# EAGLE design Oledy (EAGLE 5.11)
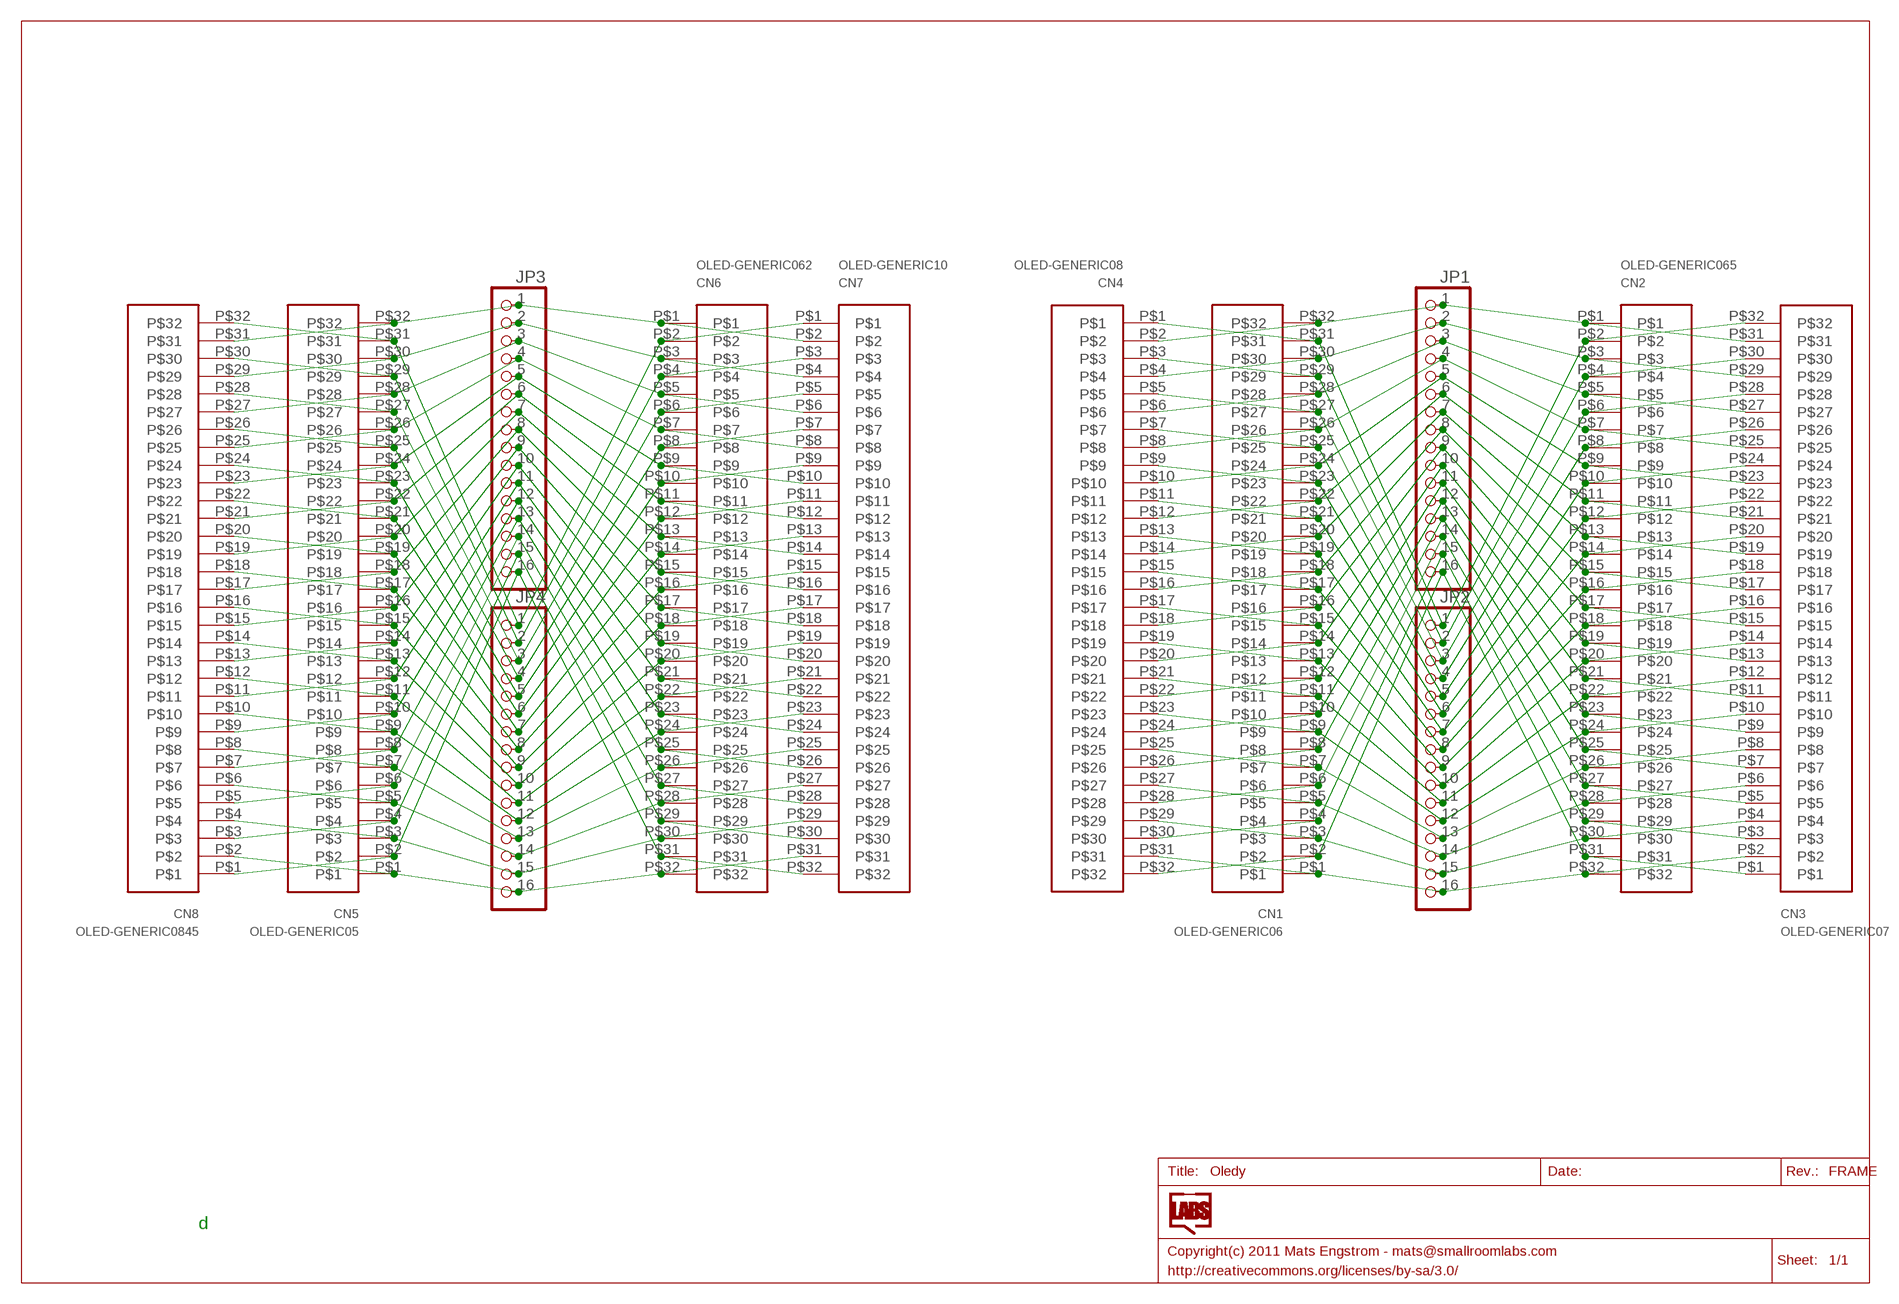
[diagram p0: schematic, sheet 1]

## Parts
CN1  OLED-GENERIC06  [OLED-GENERIC-0.6]
CN2  OLED-GENERIC065  [OLED-GENERIC-0.65]
CN3  OLED-GENERIC07  [OLED-GENERIC-0.7]
CN4  OLED-GENERIC08  [OLED-GENERIC-0.8]
CN5  OLED-GENERIC05  [OLED-GENERIC-0.5]
CN6  OLED-GENERIC062  [OLED-GENERIC-0.62]
CN7  OLED-GENERIC10  [OLED-GENERIC-1.0]
CN8  OLED-GENERIC0845  [OLED-GENERIC-0.845]
JP1  HEADER-1X16ROUND  [1X16_ROUND]
JP2  HEADER-1X16ROUND  [1X16_ROUND]
JP3  HEADER-1X16ROUND  [1X16_ROUND]
JP4  HEADER-1X16ROUND  [1X16_ROUND]

## Nets
N$1: CN1.P$1 CN2.P$32 CN3.P$2 CN4.P$31 JP2.16
N$2: CN1.P$2 CN2.P$31 CN3.P$1 CN4.P$32 JP1.16
N$3: CN1.P$3 CN2.P$30 CN3.P$4 CN4.P$29 JP2.15
N$4: CN1.P$5 CN2.P$28 CN3.P$6 CN4.P$27 JP2.14
N$5: CN1.P$7 CN2.P$26 CN3.P$8 CN4.P$25 JP2.13
N$6: CN1.P$9 CN2.P$24 CN3.P$10 CN4.P$23 JP2.12
N$7: CN1.P$4 CN2.P$29 CN3.P$3 CN4.P$30 JP1.15
N$8: CN1.P$6 CN2.P$27 CN3.P$5 CN4.P$28 JP1.14
N$9: CN1.P$8 CN2.P$25 CN3.P$7 CN4.P$26 JP1.13
N$10: CN1.P$10 CN2.P$23 CN3.P$9 CN4.P$24 JP1.12
N$11: CN1.P$11 CN2.P$22 CN3.P$12 CN4.P$21 JP2.11
N$12: CN1.P$12 CN2.P$21 CN3.P$11 CN4.P$22 JP1.11
N$13: CN1.P$13 CN2.P$20 CN3.P$14 CN4.P$19 JP2.10
N$14: CN1.P$14 CN2.P$19 CN3.P$13 CN4.P$20 JP1.10
N$15: CN5.P$1 CN6.P$32 CN7.P$31 CN8.P$2 JP4.16
N$16: CN5.P$2 CN6.P$31 CN7.P$32 CN8.P$1 JP3.16
N$17: CN5.P$3 CN6.P$30 CN7.P$29 CN8.P$4 JP4.15
N$18: CN5.P$5 CN6.P$28 CN7.P$27 CN8.P$6 JP4.14
N$19: CN5.P$7 CN6.P$26 CN7.P$25 CN8.P$8 JP4.13
N$20: CN5.P$9 CN6.P$24 CN7.P$23 CN8.P$10 JP4.12
N$21: CN5.P$4 CN6.P$29 CN7.P$30 CN8.P$3 JP3.15
N$22: CN5.P$6 CN6.P$27 CN7.P$28 CN8.P$5 JP3.14
N$23: CN5.P$8 CN6.P$25 CN7.P$26 CN8.P$7 JP3.13
N$24: CN5.P$10 CN6.P$23 CN7.P$24 CN8.P$9 JP3.12
N$25: CN5.P$11 CN6.P$22 CN7.P$21 CN8.P$12 JP4.11
N$26: CN5.P$12 CN6.P$21 CN7.P$22 CN8.P$11 JP3.11
N$27: CN5.P$13 CN6.P$20 CN7.P$19 CN8.P$14 JP4.10
N$28: CN5.P$14 CN6.P$19 CN7.P$20 CN8.P$13 JP3.10
N$29: CN1.P$15 CN2.P$18 CN3.P$16 CN4.P$17 JP2.9
N$30: CN1.P$16 CN2.P$17 CN3.P$15 CN4.P$18 JP1.9
N$31: CN1.P$17 CN2.P$16 CN3.P$18 CN4.P$15 JP2.8
N$32: CN1.P$18 CN2.P$15 CN3.P$17 CN4.P$16 JP1.8
N$33: CN1.P$19 CN2.P$14 CN3.P$20 CN4.P$13 JP2.7
N$34: CN1.P$20 CN2.P$13 CN3.P$19 CN4.P$14 JP1.7
N$35: CN1.P$21 CN2.P$12 CN3.P$22 CN4.P$11 JP2.6
N$36: CN1.P$22 CN2.P$11 CN3.P$21 CN4.P$12 JP1.6
N$37: CN1.P$23 CN2.P$10 CN3.P$24 CN4.P$9 JP2.5
N$38: CN1.P$24 CN2.P$9 CN3.P$23 CN4.P$10 JP1.5
N$39: CN1.P$25 CN2.P$8 CN3.P$26 CN4.P$7 JP2.4
N$40: CN1.P$26 CN2.P$7 CN3.P$25 CN4.P$8 JP1.4
N$41: CN1.P$27 CN2.P$6 CN3.P$28 CN4.P$5 JP2.3
N$42: CN1.P$28 CN2.P$5 CN3.P$27 CN4.P$6 JP1.3
N$43: CN1.P$29 CN2.P$4 CN3.P$30 CN4.P$3 JP2.2
N$44: CN1.P$30 CN2.P$3 CN3.P$29 CN4.P$4 JP1.2
N$45: CN1.P$31 CN2.P$2 CN3.P$32 CN4.P$1 JP2.1
N$46: CN1.P$32 CN2.P$1 CN3.P$31 CN4.P$2 JP1.1
N$47: CN5.P$15 CN6.P$18 CN7.P$17 CN8.P$16 JP4.9
N$48: CN5.P$16 CN6.P$17 CN7.P$18 CN8.P$15 JP3.9
N$49: CN5.P$17 CN6.P$16 CN7.P$15 CN8.P$18 JP4.8
N$50: CN5.P$18 CN6.P$15 CN7.P$16 CN8.P$17 JP3.8
N$51: CN5.P$19 CN6.P$14 CN7.P$13 CN8.P$20 JP4.7
N$52: CN5.P$20 CN6.P$13 CN7.P$14 CN8.P$19 JP3.7
N$53: CN5.P$21 CN6.P$12 CN7.P$11 CN8.P$22 JP4.6
N$54: CN5.P$22 CN6.P$11 CN7.P$12 CN8.P$21 JP3.6
N$55: CN5.P$23 CN6.P$10 CN7.P$9 CN8.P$24 JP4.5
N$56: CN5.P$24 CN6.P$9 CN7.P$10 CN8.P$23 JP3.5
N$57: CN5.P$25 CN6.P$8 CN7.P$7 CN8.P$26 JP4.4
N$58: CN5.P$26 CN6.P$7 CN7.P$8 CN8.P$25 JP3.4
N$59: CN5.P$27 CN6.P$6 CN7.P$5 CN8.P$28 JP4.3
N$60: CN5.P$28 CN6.P$5 CN7.P$6 CN8.P$27 JP3.3
N$61: CN5.P$29 CN6.P$4 CN7.P$3 CN8.P$30 JP4.2
N$62: CN5.P$30 CN6.P$3 CN7.P$4 CN8.P$29 JP3.2
N$63: CN5.P$31 CN6.P$2 CN7.P$1 CN8.P$32 JP4.1
N$64: CN5.P$32 CN6.P$1 CN7.P$2 CN8.P$31 JP3.1

## Notes on the sheet
- d

## Library data of the parts
CN1-CN8 = SmallRoomLabs:OLED-GENERIC
JP1-JP4 = microbuilder:HEADER-1X16: PIN HEADER

## Net classes
0 default: width 0.203 mm, clearance 0.203 mm

## Board
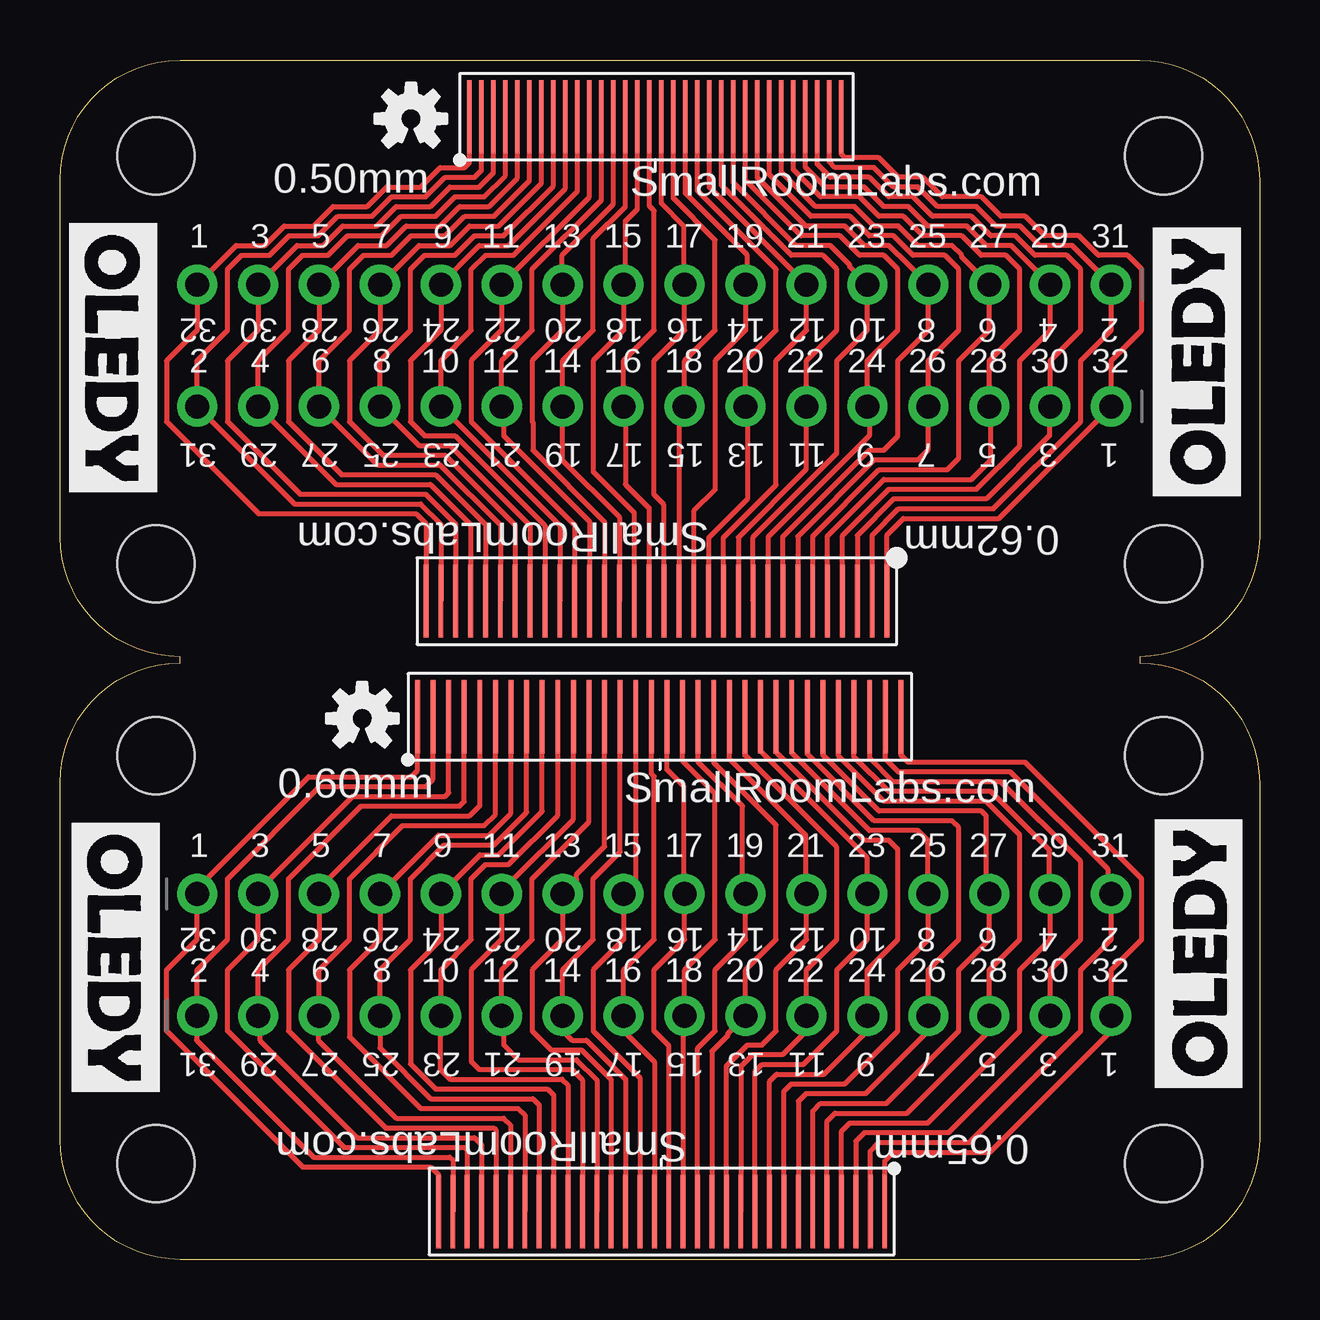
[diagram p1: board, top side]
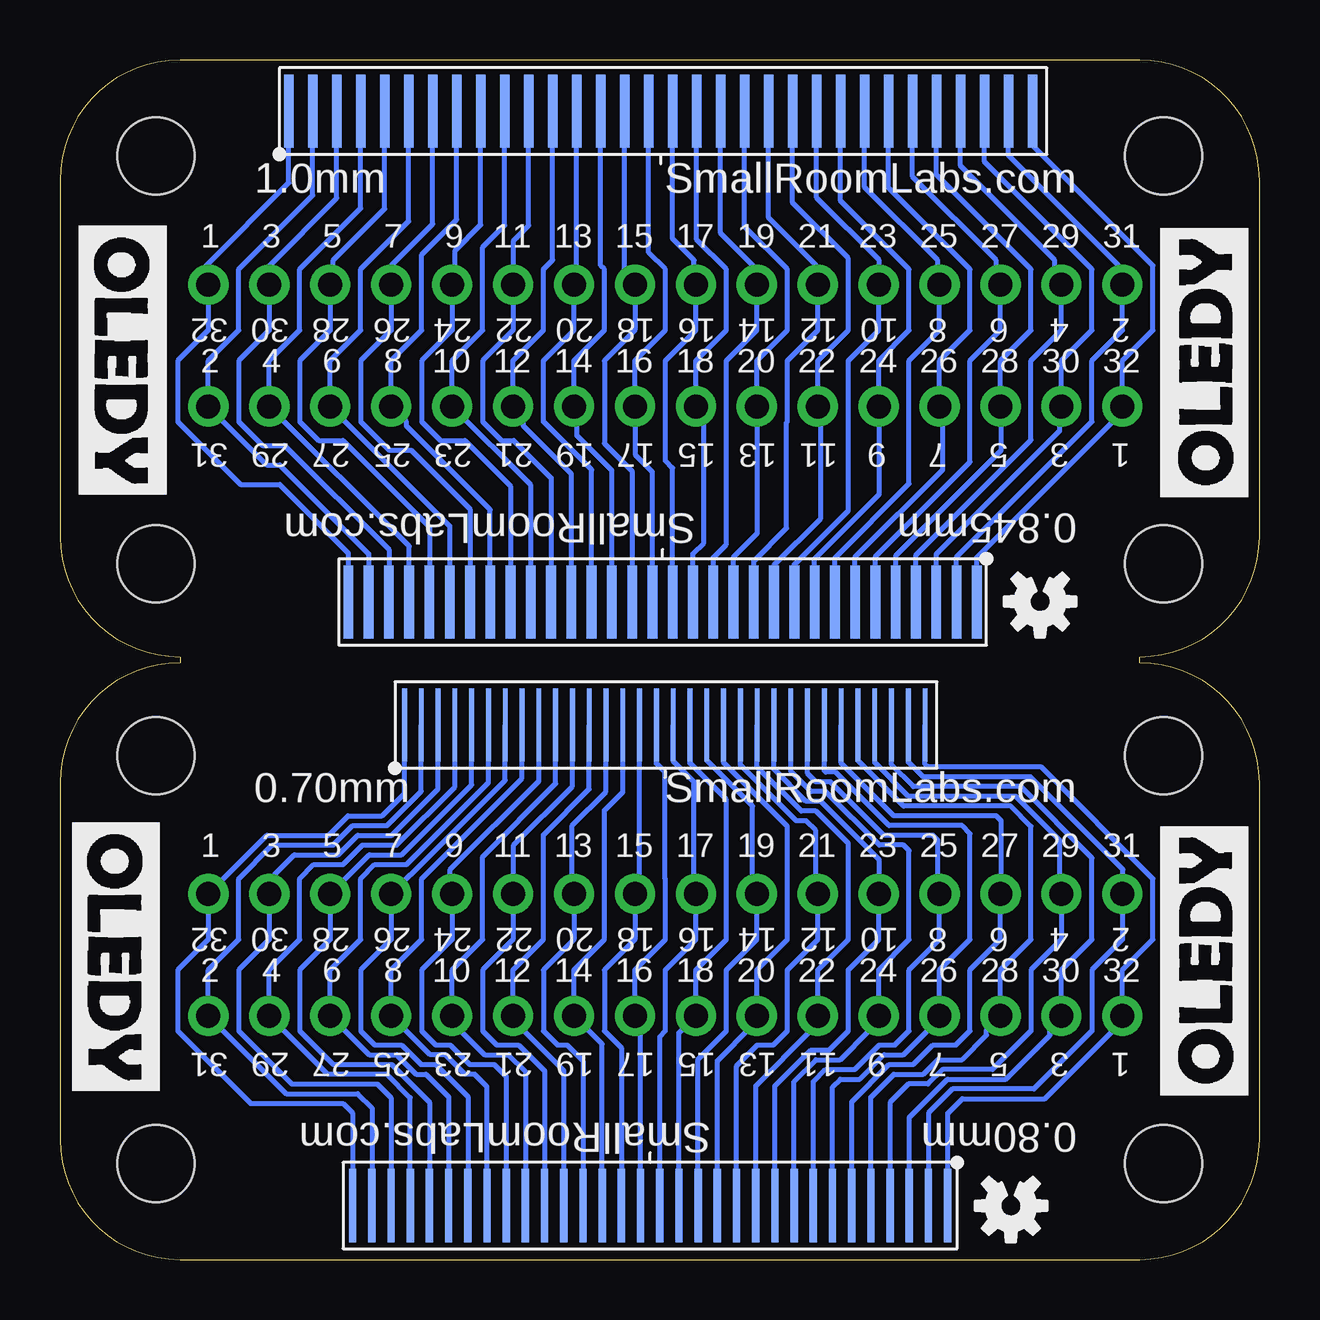
[diagram p2: board, bottom side, seen from below]

Size 50 x 50 mm. Coordinates in mm from the lower left corner, seen from the top.
Outline: 0,19.88 arc-90 5,24.88 5,25.12 arc-90 0,30.12 0,45 arc-90 5,50 45,50 arc-90 50,45 50,30.12 arc-90 45,25.12 45,24.88 arc-90 50,19.88 50,5 arc-90 45,0 5,0 arc-90 0,5 0,19.88
Copper layers (1*16): Top 0.035mm / dielectric 1.5mm / Bottom 0.035mm
Design rules "Fusion_eagle_rule_v1.1": minimum track width 6mil, minimum drill 12mil, track to track 6mil, track to pad 6mil, pad to pad 6mil, via to via 6mil, smd to smd 0mil, copper to edge 10mil, drill to drill 10mil, minimum pad ring 10mil, minimum via ring 6mil, stop-mask expansion 2mil, vias tented up to drill 100mil, thermal gap 10mil
Holes 3.2 mm at 4,4 46,4 46,21 4,21 4,46 4,29 46,29 46,46

### Footprints (pad centres in the part's own frame; a part is rotated, then mirrored left to right if it is on the bottom)
OLED-GENERIC-0.6 = smd 0.203 x 3.048: P$1 0,0; P$2 0.6,0; P$3 1.2,0; P$4 1.8,0; P$5 2.4,0; P$6 3,0; P$7 3.6,0; P$8 4.2,0; P$9 4.8,0; P$10 5.4,0; P$11 6,0; P$12 6.6,0; P$13 7.2,0; P$14 7.8,0; P$15 8.4,0; P$16 9,0; P$17 9.6,0; P$18 10.2,0; P$19 10.8,0; P$20 11.4,0; P$21 12,0; P$22 12.6,0; P$23 13.2,0; P$24 13.8,0; P$25 14.4,0; P$26 15,0; P$27 15.6,0; P$28 16.2,0; P$29 16.8,0; P$30 17.4,0; P$31 18,0; P$32 18.6,0
OLED-GENERIC-0.65 = smd 0.203 x 3.048: P$1 0,0; P$2 0.65,0; P$3 1.3,0; P$4 1.95,0; P$5 2.6,0; P$6 3.25,0; P$7 3.9,0; P$8 4.55,0; P$9 5.2,0; P$10 5.85,0; P$11 6.5,0; P$12 7.15,0; P$13 7.8,0; P$14 8.45,0; P$15 9.1,0; P$16 9.75,0; P$17 10.4,0; P$18 11.05,0; P$19 11.7,0; P$20 12.35,0; P$21 13,0; P$22 13.65,0; P$23 14.3,0; P$24 14.95,0; P$25 15.6,0; P$26 16.25,0; P$27 16.9,0; P$28 17.55,0; P$29 18.2,0; P$30 18.85,0; P$31 19.5,0; P$32 20.15,0
OLED-GENERIC-0.7 = smd 0.203 x 3.048: P$1 0,0; P$2 0.7,0; P$3 1.4,0; P$4 2.1,0; P$5 2.8,0; P$6 3.5,0; P$7 4.2,0; P$8 4.9,0; P$9 5.6,0; P$10 6.3,0; P$11 7,0; P$12 7.7,0; P$13 8.4,0; P$14 9.1,0; P$15 9.8,0; P$16 10.5,0; P$17 11.2,0; P$18 11.9,0; P$19 12.6,0; P$20 13.3,0; P$21 14,0; P$22 14.7,0; P$23 15.4,0; P$24 16.1,0; P$25 16.8,0; P$26 17.5,0; P$27 18.2,0; P$28 18.9,0; P$29 19.6,0; P$30 20.3,0; P$31 21,0; P$32 21.7,0
OLED-GENERIC-0.8 = smd 0.305 x 3.048: P$1 0,0; P$2 0.8,0; P$3 1.6,0; P$4 2.4,0; P$5 3.2,0; P$6 4,0; P$7 4.8,0; P$8 5.6,0; P$9 6.4,0; P$10 7.2,0; P$11 8,0; P$12 8.8,0; P$13 9.6,0; P$14 10.4,0; P$15 11.2,0; P$16 12,0; P$17 12.8,0; P$18 13.6,0; P$19 14.4,0; P$20 15.2,0; P$21 16,0; P$22 16.8,0; P$23 17.6,0; P$24 18.4,0; P$25 19.2,0; P$26 20,0; P$27 20.8,0; P$28 21.6,0; P$29 22.4,0; P$30 23.2,0; P$31 24,0; P$32 24.8,0
OLED-GENERIC-0.5 = smd 0.203 x 3.048: P$1 0,0; P$2 0.5,0; P$3 1,0; P$4 1.5,0; P$5 2,0; P$6 2.5,0; P$7 3,0; P$8 3.5,0; P$9 4,0; P$10 4.5,0; P$11 5,0; P$12 5.5,0; P$13 6,0; P$14 6.5,0; P$15 7,0; P$16 7.5,0; P$17 8,0; P$18 8.5,0; P$19 9,0; P$20 9.5,0; P$21 10,0; P$22 10.5,0; P$23 11,0; P$24 11.5,0; P$25 12,0; P$26 12.5,0; P$27 13,0; P$28 13.5,0; P$29 14,0; P$30 14.5,0; P$31 15,0; P$32 15.5,0
OLED-GENERIC-0.62 = smd 0.203 x 3.048: P$1 0,0; P$2 0.62,0; P$3 1.24,0; P$4 1.86,0; P$5 2.48,0; P$6 3.1,0; P$7 3.72,0; P$8 4.34,0; P$9 4.96,0; P$10 5.58,0; P$11 6.2,0; P$12 6.82,0; P$13 7.44,0; P$14 8.06,0; P$15 8.68,0; P$16 9.3,0; P$17 9.92,0; P$18 10.54,0; P$19 11.16,0; P$20 11.78,0; P$21 12.4,0; P$22 13.02,0; P$23 13.64,0; P$24 14.26,0; P$25 14.88,0; P$26 15.5,0; P$27 16.12,0; P$28 16.74,0; P$29 17.36,0; P$30 17.98,0; P$31 18.6,0; P$32 19.22,0
OLED-GENERIC-1.0 = smd 0.406 x 3.048: P$1 0,0; P$2 1,0; P$3 2,0; P$4 3,0; P$5 4,0; P$6 5,0; P$7 6,0; P$8 7,0; P$9 8,0; P$10 9,0; P$11 10,0; P$12 11,0; P$13 12,0; P$14 13,0; P$15 14,0; P$16 15,0; P$17 16,0; P$18 17,0; P$19 18,0; P$20 19,0; P$21 20,0; P$22 21,0; P$23 22,0; P$24 23,0; P$25 24,0; P$26 25,0; P$27 26,0; P$28 27,0; P$29 28,0; P$30 29,0; P$31 30,0; P$32 31,0
OLED-GENERIC-0.845 = smd 0.406 x 3.048: P$1 0,0; P$2 0.845,0; P$3 1.69,0; P$4 2.535,0; P$5 3.38,0; P$6 4.225,0; P$7 5.07,0; P$8 5.915,0; P$9 6.76,0; P$10 7.605,0; P$11 8.45,0; P$12 9.295,0; P$13 10.14,0; P$14 10.985,0; P$15 11.83,0; P$16 12.675,0; P$17 13.52,0; P$18 14.365,0; P$19 15.21,0; P$20 16.055,0; P$21 16.9,0; P$22 17.745,0; P$23 18.59,0; P$24 19.435,0; P$25 20.28,0; P$26 21.125,0; P$27 21.97,0; P$28 22.815,0; P$29 23.66,0; P$30 24.505,0; P$31 25.35,0; P$32 26.195,0
1X16_ROUND = drill 1 pad 1.676 round: 1 -19.05,0; 2 -16.51,0; 3 -13.97,0; 4 -11.43,0; 5 -8.89,0; 6 -6.35,0; 7 -3.81,0; 8 -1.27,0; 9 1.27,0; 10 3.81,0; 11 6.35,0; 12 8.89,0; 13 11.43,0; 14 13.97,0; 15 16.51,0; 16 19.05,0

### Placement (x,y rotation side)
CN1  34.38,2 180 top
CN2  14.9,22.62 0 top
CN3  35.64,22.28 0 bottom
CN4  13,2.25 180 bottom
CN5  17.07,47.63 0 top
CN6  34.48,27.45 180 top
CN7  40.46,47.87 0 bottom
CN8  11.79,27.41 180 bottom
JP1  24.77,15.24 0 top
JP2  24.77,10.16 0 top
JP3  24.77,35.56 180 top
JP4  24.77,40.64 180 top
U$2  [OSHW-LOGO-S]  9.14,27.43 180 bottom
U$3  [OSHW-LOGO-S]  10.36,2.24 180 bottom
U$4  [OSHW-LOGO-S]  14.63,47.55 0 top
U$5  [OSHW-LOGO-S]  12.6,22.56 0 top

### Tracks (layer width: path | path; a pad name or v marks a point on that pad's centre or on a via)
N$1
  Top 0.203: CN1.P$1 34.38,4.1 34.75,4.47 38.76,4.47 43.81,9.53 JP2.16 43.81,12.06 45.09,13.34 45.09,15.88 40.23,20.73 35.36,20.73 35.05,21.03 CN2.P$32
  Bottom 0.203: JP2.16 43.81,10.79 | CN3.P$2 34.94,19.52 36.37,18.09 37.8,18.09 38.61,17.27 41.15,17.27 42.55,15.88 42.55,13.34 43.81,12.06 JP2.16 | CN4.P$31 37,6.32 37.59,6.91 40.56,6.91 JP2.16
N$2
  Top 0.203: CN1.P$2 33.77,4.51 34.14,4.88 37.9,4.88 42.55,9.53 42.55,12.06 43.81,13.34 JP1.16 43.69,15.37 43.69,16.26 39.62,20.32 34.95,20.32 34.4,20.87 CN2.P$31
  Bottom 0.203: CN3.P$1 35.64,19.43 36.58,18.49 38,18.49 38.81,17.68 41.38,17.68 JP1.16 43.81,13.34 45.09,12.06 45.09,9.53 42.06,6.5 38.2,6.5 37.81,6.11 CN4.P$32
N$3
  Top 0.203: CN1.P$3 33.17,4.93 33.53,5.28 37.03,5.28 41.27,9.53 JP2.15 41.27,12.06 42.55,13.34 42.55,16.59 39.22,19.91 34.75,19.91 33.75,20.91 CN2.P$30
  Bottom 0.203: CN3.P$4 33.54,19.7 35.97,17.27 37.39,17.27 38.2,16.46 39.42,16.46 40.01,15.88 40.01,13.34 41.27,12.06 JP2.15 38.84,7.72 36.37,7.72 35.4,6.75 CN4.P$29
N$4
  Top 0.203: CN1.P$5 31.98,5.76 32.31,6.1 35.31,6.1 38.73,9.53 JP2.14 38.73,12.06 40.01,13.34 40.01,17.7 38.61,19.1 34.34,19.1 32.45,20.99 CN2.P$28
  Bottom 0.203: CN3.P$6 32.14,19.88 35.56,16.46 36.88,16.46 37.47,15.88 37.47,13.34 38.73,12.06 JP2.14 37.11,8.53 35.97,8.53 35.15,7.72 34.75,7.72 33.8,6.77 CN4.P$27
N$5
  Top 0.203: CN1.P$7 30.77,6.59 31.09,6.91 33.58,6.91 36.2,9.53 JP2.13 36.2,12.06 37.47,13.34 37.47,18.01 37.19,18.29 33.93,18.29 31.15,21.07 CN2.P$26
  Bottom 0.203: CN3.P$8 30.74,20.06 34.92,15.88 34.92,13.34 36.2,12.06 JP2.13 34.57,8.53 33.93,8.53 33.12,7.72 32.72,7.72 32.2,7.21 CN4.P$25
N$6
  Top 0.203: CN1.P$9 29.57,7.43 29.87,7.72 31.85,7.72 33.66,9.53 JP2.12 33.66,12.06 34.92,13.34 34.92,17.09 34.54,17.48 33.53,17.48 29.85,21.15 CN2.P$24
  Bottom 0.203: CN3.P$10 29.34,19.83 32.38,16.79 32.38,13.34 33.66,12.06 JP2.12 33.33,9.83 33.33,9.55 32.31,8.53 31.29,8.53 30.6,7.84 CN4.P$23
N$7
  Top 0.203: CN1.P$4 32.58,5.35 32.92,5.69 36.17,5.69 40.01,9.53 40.01,12.06 41.27,13.34 JP1.15 41.25,15.27 41.25,17.07 38.81,19.51 34.54,19.51 33.1,20.95 CN2.P$29
  Bottom 0.203: CN3.P$3 34.24,19.61 36.17,17.68 37.59,17.68 38.41,16.87 40.23,16.87 41.05,16.05 41.05,15.47 JP1.15 41.27,13.34 42.55,12.06 42.55,9.53 40.34,7.32 36.78,7.32 36.2,6.74 CN4.P$30
N$8
  Top 0.203: CN1.P$6 31.38,6.18 31.7,6.5 34.44,6.5 37.47,9.53 37.47,12.06 38.73,13.34 JP1.14 38.61,15.37 38.61,18.49 38.41,18.69 34.14,18.69 31.8,21.03 CN2.P$27
  Bottom 0.203: CN3.P$5 32.84,19.79 35.76,16.87 37.11,16.87 JP1.14 38.73,13.34 40.01,12.06 40.01,9.53 38.61,8.13 36.17,8.13 34.6,6.56 CN4.P$28
N$9
  Top 0.203: CN1.P$8 30.18,7.01 30.48,7.32 32.72,7.32 34.92,9.53 34.92,12.06 36.2,13.34 JP1.13 36.17,15.27 36.17,17.48 35.76,17.88 33.73,17.88 30.5,21.11 CN2.P$25
  Bottom 0.203: CN3.P$7 31.44,19.97 35.36,16.05 35.38,16.05 JP1.13 36.2,13.34 37.47,12.06 37.47,9.53 36.88,8.94 35.76,8.94 34.95,8.13 34.34,8.13 33,6.79 CN4.P$26
N$10
  Top 0.203: CN1.P$10 28.98,7.84 29.26,8.13 30.99,8.13 32.38,9.53 32.38,12.06 33.66,13.34 JP1.12 33.66,16.74 29.2,21.19 CN2.P$23
  Bottom 0.203: CN3.P$9 30.04,19.95 33.73,16.26 33.73,15.32 JP1.12 33.66,13.34 34.92,12.06 34.92,9.53 34.34,8.94 33.73,8.94 32.92,8.13 31.9,8.13 31.4,7.63 CN4.P$24
N$11
  Top 0.203: CN1.P$11 28.38,8.05 28.85,8.53 30.12,8.53 31.11,9.53 JP2.11 31.11,12.06 32.38,13.34 32.38,17.2 28.55,21.03 CN2.P$22
  Bottom 0.203: CN3.P$12 27.94,19.61 29.84,17.7 29.84,13.34 31.11,12.06 JP2.11 30.68,9.73 30.68,9.55 29,7.87 CN4.P$21
N$12
  Top 0.203: CN1.P$12 27.77,8.06 28.65,8.94 29.26,8.94 29.84,9.53 29.84,12.06 31.11,13.34 JP1.11 31.09,15.27 31.09,17.68 27.9,20.87 CN2.P$21
  Bottom 0.203: CN3.P$11 28.64,19.72 31.09,17.27 31.09,15.27 JP1.11 31.11,13.34 32.38,12.06 32.38,9.53 31.8,8.94 30.89,8.94 29.8,7.85 CN4.P$22
N$13
  Top 0.203: JP2.10 28.57,12.06 29.84,13.34 29.84,18.11 27.25,20.7 CN2.P$20 | JP2.10 28.57,9.53 | CN1.P$13 27.18,8.68 27.84,9.35 27.84,9.42 JP2.10
  Bottom 0.203: CN3.P$14 26.54,19.48 27.3,18.72 27.3,13.34 28.57,12.06 JP2.10 27.4,8.98 CN4.P$19
N$14
  Top 0.203: CN1.P$14 26.57,8.79 27.3,9.53 27.3,12.06 28.57,13.34 JP1.10 28.45,15.37 28.45,18.9 26.6,20.75 CN2.P$19
  Bottom 0.203: CN3.P$13 27.24,19.5 28.65,18.09 28.65,15.32 JP1.10 28.57,13.34 29.84,12.06 29.84,9.53 29.26,8.94 28.85,8.94 28.2,8.29 CN4.P$20
N$15
  Top 0.203: CN6.P$32 15.26,30.67 14.83,31.09 8.28,31.09 4.45,34.92 4.45,37.47 5.71,38.73 JP4.16 7.34,42.27 8.53,42.27 9.35,43.08 10.57,43.08 11.38,43.89 12.8,43.89 13.61,44.7 15.04,44.7 15.85,45.52 16.87,45.52 17.07,45.72 CN5.P$1
  Bottom 0.203: CN8.P$2 12.63,29.28 6.99,34.92 6.99,37.47 5.71,38.73 JP4.16 5.89,40.82 5.89,41.45 10.46,46.02 CN7.P$31
N$16
  Top 0.203: CN6.P$31 15.88,30.66 15.04,31.5 9.78,31.5 JP3.16 5.71,37.47 6.99,38.73 6.99,41.27 7.57,41.86 8.74,41.86 9.55,42.67 10.77,42.67 11.58,43.48 13.01,43.48 13.82,44.3 15.24,44.3 16.05,45.11 17.27,45.11 17.57,45.4 CN5.P$2
  Bottom 0.203: JP3.16 5.71,37.47 4.45,38.73 4.45,41.43 9.46,46.45 CN7.P$32 | JP3.16 5.69,35.53 | CN8.P$1 11.79,29.26 6.1,34.95 6.1,35.18 JP3.16
N$17
  Top 0.203: CN6.P$30 16.5,30.65 15.24,31.9 10.01,31.9 6.99,34.92 6.99,37.47 8.26,38.73 JP4.15 9.88,42.27 10.97,42.27 11.79,43.08 13.21,43.08 14.02,43.89 15.44,43.89 16.26,44.7 17.48,44.7 18.07,45.29 CN5.P$3
  Bottom 0.203: CN8.P$4 14.32,29.37 9.53,34.16 9.53,37.47 8.26,38.73 JP4.15 8.53,40.92 8.53,41.66 12.46,45.58 CN7.P$29
N$18
  Top 0.203: CN6.P$28 17.73,30.63 15.65,32.72 11.73,32.72 9.53,34.92 9.53,37.47 10.79,38.73 JP4.14 12.42,42.27 13.61,42.27 14.43,43.08 15.85,43.08 16.66,43.89 17.88,43.89 19.07,45.08 CN5.P$5
  Bottom 0.203: CN8.P$6 16.01,29.3 12.06,33.25 12.06,37.47 10.79,38.73 JP4.14 10.97,40.82 10.97,41.66 14.46,45.15 CN7.P$27
N$19
  Top 0.203: CN6.P$26 18.98,30.61 16.05,33.53 13.46,33.53 12.06,34.92 12.06,37.47 13.34,38.73 JP4.13 14.96,42.27 16.26,42.27 17.07,43.08 18.29,43.08 20.07,44.85 CN5.P$7
  Bottom 0.203: CN8.P$8 17.7,29.24 14.61,32.33 14.61,37.47 13.34,38.73 JP4.13 13.41,40.72 13.41,41.66 16.46,44.71 CN7.P$25
N$20
  Top 0.203: CN6.P$24 20.21,30.59 16.46,34.34 15.19,34.34 14.61,34.92 14.61,37.47 15.88,38.73 JP4.12 16.66,41.43 16.66,41.45 17.48,42.27 18.69,42.27 21.07,44.64 CN5.P$9
  Bottom 0.203: CN8.P$10 19.39,28.97 17.14,31.22 17.14,37.47 15.88,38.73 JP4.12 15.85,40.66 15.85,41.66 18.46,44.27 CN7.P$23
N$21
  Top 0.203: CN6.P$29 17.11,30.64 15.44,32.31 11.51,32.31 JP3.15 8.26,37.47 9.53,38.73 9.53,41.27 10.11,41.86 11.18,41.86 11.99,42.67 13.41,42.67 14.22,43.48 15.65,43.48 16.46,44.3 17.68,44.3 18.57,45.18 CN5.P$4
  Bottom 0.203: CN8.P$3 13.47,29.4 8.33,34.54 8.33,35.48 JP3.15 8.26,37.47 6.99,38.73 6.99,41.27 11.46,45.75 CN7.P$30
N$22
  Top 0.203: CN6.P$27 18.36,30.62 15.85,33.12 13.23,33.12 JP3.14 10.79,37.47 12.06,38.73 12.06,41.27 12.65,41.86 13.82,41.86 14.63,42.67 16.05,42.67 16.87,43.48 18.09,43.48 19.57,44.97 CN5.P$6
  Bottom 0.203: CN8.P$5 15.16,29.34 10.77,33.73 10.77,35.53 JP3.14 10.79,37.47 9.53,38.73 9.53,41.27 13.46,45.21 CN7.P$28
N$23
  Top 0.203: CN6.P$25 19.59,30.59 16.26,33.93 14.96,33.93 JP3.13 13.34,37.47 14.61,38.73 14.61,41.27 15.19,41.86 16.46,41.86 17.27,42.67 18.49,42.67 20.57,44.75 CN5.P$8
  Bottom 0.203: CN8.P$7 16.86,29.27 13.21,32.92 13.21,35.43 JP3.13 13.34,37.47 12.06,38.73 12.06,41.27 15.46,44.67 CN7.P$26
N$24
  Top 0.203: CN6.P$23 20.84,30.6 JP3.12 15.88,37.47 17.14,38.73 17.14,41.27 17.73,41.86 18.9,41.86 21.57,44.53 CN5.P$10
  Bottom 0.203: CN8.P$9 18.55,29.21 15.85,31.9 15.85,35.53 JP3.12 15.88,37.47 14.61,38.73 14.61,41.27 17.46,44.13 CN7.P$24
N$25
  Top 0.203: CN6.P$22 21.45,30.61 17.14,34.92 17.14,37.47 18.41,38.73 JP4.11 22.07,44.29 CN5.P$11
  Bottom 0.203: CN8.P$12 21.08,29.11 19.71,30.48 19.71,34.9 19.68,34.92 19.68,37.47 18.41,38.73 JP4.11 18.49,40.72 18.49,41.45 20.46,43.42 CN7.P$21
N$26
  Top 0.203: CN6.P$21 22.07,30.76 18.49,34.34 18.49,35.48 JP3.11 18.41,37.47 19.68,38.73 19.68,41.27 22.57,44.16 CN5.P$12
  Bottom 0.203: CN8.P$11 20.23,28.94 18.29,30.89 18.29,35.43 JP3.11 18.41,37.47 17.14,38.73 17.14,41.73 19.46,44.05 CN7.P$22
N$27
  Top 0.203: CN6.P$20 22.7,30.75 19.71,33.73 19.71,34.9 19.68,34.92 19.68,37.47 20.95,38.73 JP4.10 20.93,40.66 20.93,41.86 23.07,43.99 CN5.P$13
  Bottom 0.203: CN8.P$14 22.77,29.26 22.23,29.81 22.23,37.47 20.95,38.73 JP4.10 20.93,40.66 20.93,41.25 22.46,42.78 CN7.P$19
N$28
  Top 0.203: CN6.P$19 23.32,30.94 20.93,33.33 20.93,35.53 JP3.10 20.95,37.47 22.23,38.73 22.23,42.55 23.57,43.88 CN5.P$14
  Bottom 0.203: CN8.P$13 21.93,29.28 20.93,30.28 20.93,35.53 JP3.10 20.95,37.47 19.68,38.73 19.68,41.27 21.46,43.05 CN7.P$20
N$29
  Top 0.203: CN1.P$15 25.98,10.1 JP2.9 26.04,12.06 27.3,13.34 27.3,19.43 25.95,20.79 CN2.P$18
  Bottom 0.203: CN3.P$16 25.14,20.67 24.79,20.32 24.79,15.9 24.77,15.88 24.77,13.34 26.04,12.06 JP2.9 25.8,9.93 CN4.P$17
N$30
  Top 0.203: CN1.P$16 25.38,8.91 24.77,9.53 24.77,12.06 26.04,13.34 JP1.9 26.01,15.27 26.01,19.71 25.3,20.42 CN2.P$17
  Bottom 0.203: CN3.P$15 25.84,15.44 JP1.9 26.04,13.34 27.3,12.06 27.3,9.53 26.6,8.82 CN4.P$18
N$31
  Top 0.203: CN1.P$17 24.77,8.24 23.5,9.53 JP2.8 23.5,12.06 24.77,13.34 24.77,20.14 24.65,20.26 CN2.P$16
  Bottom 0.203: CN3.P$18 23.74,20.69 22.23,19.18 22.23,13.34 23.5,12.06 JP2.8 24.2,9.46 CN4.P$15
N$32
  Top 0.203: CN1.P$18 24.18,7.58 22.23,9.53 22.23,12.06 23.5,13.34 JP1.8 24,15.74 CN2.P$15
  Bottom 0.203: CN3.P$17 24.44,20.78 23.57,19.91 23.57,15.32 JP1.8 23.5,13.34 24.77,12.06 24.77,9.53 25,9.29 CN4.P$16
N$33
  Top 0.203: CN1.P$19 23.57,7.51 21.95,9.14 21.34,9.14 20.95,9.53 JP2.7 20.95,12.06 22.23,13.34 22.23,15.88 23.35,17 CN2.P$14
  Bottom 0.203: CN3.P$20 22.34,20.71 19.68,18.06 19.68,13.34 20.95,12.06 JP2.7 21.13,9.98 21.13,9.75 22.6,8.29 CN4.P$13
N$34
  Top 0.203: CN1.P$20 22.98,7.5 21.74,8.74 20.47,8.74 19.68,9.53 19.68,12.06 20.95,13.34 JP1.7 21.54,15.82 21.54,16.05 22.7,17.21 CN2.P$13
  Bottom 0.203: CN3.P$19 23.04,20.8 21.13,18.9 21.13,15.42 JP1.7 20.95,13.34 22.23,12.06 22.23,9.53 23.4,8.35 CN4.P$14
N$35
  Top 0.203: CN1.P$21 22.38,7.5 21.54,8.33 19.1,8.33 18.49,8.94 18.49,9.45 18.41,9.53 JP2.6 18.41,12.06 19.68,13.34 19.68,15.88 22.05,18.24 CN2.P$12
  Bottom 0.203: CN3.P$22 20.94,20.53 19.1,18.69 18.49,18.69 17.14,17.35 17.14,13.34 18.41,12.06 JP2.6 18.69,9.88 18.69,9.55 21,7.25 CN4.P$11
N$36
  Top 0.203: CN1.P$22 21.77,7.49 21.34,7.92 17.48,7.92 17.14,8.26 17.14,12.06 18.41,13.34 JP1.6 18.69,15.52 18.69,15.65 21.4,18.35 CN2.P$11
  Bottom 0.203: CN3.P$21 21.64,20.62 19.3,18.29 18.9,18.29 18.49,17.88 18.49,15.32 JP1.6 18.41,13.34 19.68,12.06 19.68,9.53 20.27,8.94 20.93,8.94 21.8,8.07 CN4.P$12
N$37
  Top 0.203: CN1.P$23 21.18,7.27 20.93,7.52 16.26,7.52 15.85,7.92 15.85,9.5 15.88,9.53 JP2.5 15.88,12.06 17.14,13.34 17.14,15.88 17.73,16.46 18.69,16.46 20.75,18.52 CN2.P$10
  Bottom 0.203: CN3.P$24 19.54,20.35 18.69,19.51 18.09,19.51 15.85,17.27 14.83,17.27 14.61,17.04 14.61,13.34 15.88,12.06 JP2.5 16.26,9.78 16.26,9.55 17.48,8.33 18.49,8.33 19.4,7.42 CN4.P$9
N$38
  Top 0.203: CN1.P$24 20.57,6.86 20.32,7.11 15.65,7.11 14.61,8.15 14.61,12.06 15.88,13.34 JP1.5 17.5,16.87 18.29,16.87 20.1,18.68 CN2.P$9
  Bottom 0.203: CN3.P$23 20.24,20.44 18.9,19.1 18.29,19.1 15.85,16.66 15.85,15.27 JP1.5 15.88,13.34 17.14,12.06 17.14,9.53 17.93,8.74 18.69,8.74 20.2,7.23 CN4.P$10
N$39
  Top 0.203: CN1.P$25 19.98,6.44 19.71,6.71 15.44,6.71 13.34,8.81 JP2.4 13.34,12.06 14.61,13.34 14.61,15.88 16,17.27 18.09,17.27 19.45,18.64 CN2.P$8
  Bottom 0.203: CN3.P$26 18.14,20.38 18.09,20.32 17.68,20.32 15.44,18.09 12.39,18.09 12.06,17.75 12.06,13.34 13.34,12.06 JP2.4 13.34,10.03 14.83,8.53 15.65,8.53 16.66,7.52 17.48,7.52 17.8,7.19 CN4.P$7
N$40
  Top 0.203: CN1.P$26 19.38,6.03 19.1,6.3 15.04,6.3 12.06,9.27 12.06,12.06 13.34,13.34 JP1.4 15.77,17.68 17.88,17.68 18.8,18.6 CN2.P$7
  Bottom 0.203: CN3.P$25 18.84,20.26 18.49,19.91 17.88,19.91 15.65,17.68 13.61,17.68 13.41,17.48 13.41,15.32 JP1.4 13.34,13.34 14.61,12.06 14.61,9.53 15.19,8.94 15.85,8.94 16.87,7.92 18.09,7.92 18.6,7.41 CN4.P$8
N$41
  Top 0.203: CN1.P$27 18.77,5.61 18.49,5.89 14.02,5.89 10.77,9.14 10.77,10.13 JP2.3 10.79,12.06 12.06,13.34 12.06,15.88 14.28,18.09 17.68,18.09 18.15,18.56 CN2.P$6
  Bottom 0.203: CN3.P$28 16.74,20.8 14.83,18.9 10.36,18.9 9.53,18.06 9.53,13.34 10.79,12.06 JP2.3 11.38,9.58 11.38,9.35 12.39,8.33 13.41,8.33 14.02,7.72 15.24,7.72 16.2,6.76 CN4.P$5
N$42
  Top 0.203: CN1.P$28 18.18,5.4 18.09,5.49 13.56,5.49 9.53,9.53 9.53,12.06 10.79,13.34 JP1.3 11.18,15.62 11.18,15.85 13.82,18.49 17.07,18.49 17.5,18.92 CN2.P$5
  Bottom 0.203: CN3.P$27 17.44,20.69 15.24,18.49 10.97,18.49 10.77,18.29 10.77,15.27 JP1.3 10.79,13.34 12.06,12.06 12.06,9.53 12.65,8.94 13.61,8.94 14.43,8.13 15.44,8.13 17,6.57 CN4.P$6
N$43
  Top 0.203: CN1.P$29 17.57,4.78 17.27,5.08 12.39,5.08 8.33,9.14 8.33,10.08 JP2.2 8.26,12.06 9.53,13.34 9.53,15.88 12.55,18.9 16.66,18.9 16.85,19.09 CN2.P$4
  Bottom 0.203: CN3.P$30 15.34,20.62 14.43,19.71 9.96,19.71 6.99,16.74 6.99,13.34 8.26,12.06 JP2.2 8.74,9.68 8.74,9.35 10.57,7.52 13.01,7.52 14.6,5.92 CN4.P$3
N$44
  Top 0.203: CN1.P$30 16.98,4.56 16.87,4.67 11.84,4.67 6.99,9.53 6.99,12.06 8.26,13.34 JP1.2 8.74,15.72 8.74,15.85 12.19,19.3 16.05,19.3 16.2,19.45 CN2.P$3
  Bottom 0.203: CN3.P$29 16.04,20.71 14.63,19.3 10.16,19.3 8.33,17.48 8.33,15.32 JP1.2 8.26,13.34 9.53,12.06 9.53,9.53 11.12,7.92 13.21,7.92 13.82,7.32 14.63,7.32 15.4,6.55 CN4.P$4
N$45
  Top 0.203: CN1.P$31 16.38,4.15 16.26,4.27 10.57,4.27 5.69,9.14 5.69,10.13 JP2.1 5.71,12.06 6.99,13.34 6.99,15.88 10.82,19.71 15.24,19.71 15.55,20.02 CN2.P$2
  Bottom 0.203: CN3.P$32 13.94,20.65 13.82,20.52 9.09,20.52 4.45,15.88 4.45,13.34 5.71,12.06 JP2.1 6.1,9.78 6.1,9.55 8.94,6.71 12.39,6.71 13,6.1 CN4.P$1
N$46
  Top 0.203: CN1.P$32 15.78,3.53 15.44,3.86 10.11,3.86 4.45,9.53 4.45,12.06 5.71,13.34 JP1.1 6.1,15.62 6.1,15.85 10.36,20.12 14.63,20.12 14.9,20.39 CN2.P$1
  Bottom 0.203: CN3.P$31 14.64,20.74 14.02,20.12 9.55,20.12 5.69,16.26 5.69,15.27 JP1.1 5.71,13.34 6.99,12.06 6.99,9.53 9.4,7.11 12.8,7.11 13.8,6.11 CN4.P$2
N$47
  Top 0.203: CN6.P$18 23.93,31.13 22.23,32.84 22.23,37.47 23.5,38.73 JP4.9 23.5,41.17 23.57,41.25 23.57,43.28 24.07,43.77 CN5.P$15
  Bottom 0.203: CN8.P$16 24.46,32.99 24.77,33.3 24.77,37.47 23.5,38.73 JP4.9 23.57,40.72 23.57,41.66 24.46,42.55 CN7.P$17
N$48
  Top 0.203: CN6.P$17 24.55,31.32 23.57,32.31 23.57,35.48 JP3.9 23.5,37.47 24.77,38.73 24.77,43.71 24.57,43.91 CN5.P$16
  Bottom 0.203: CN8.P$15 23.61,29.42 23.16,29.87 23.16,35.23 JP3.9 23.5,37.47 22.23,38.73 22.23,41.27 23.46,42.51 CN7.P$18
N$49
  Top 0.203: CN6.P$16 25.18,31.47 24.77,31.88 24.77,37.47 26.04,38.73 JP4.8 26.01,40.66 26.01,43.08 25.07,44.02 CN5.P$17
  Bottom 0.203: CN8.P$18 26.15,32.86 27.3,34.01 27.3,37.47 26.04,38.73 JP4.8 26.46,41.07 CN7.P$15
N$50
  Top 0.203: CN6.P$15 25.8,35.32 JP3.8 26.04,37.47 27.3,38.73 27.3,42.49 25.57,44.23 CN5.P$18
  Bottom 0.203: CN8.P$17 25.3,32.82 26.01,33.53 26.01,35.53 JP3.8 26.04,37.47 24.77,38.73 24.77,41.27 25.46,41.97 CN7.P$16
N$51
  Top 0.203: CN6.P$14 26.41,31.19 27.3,32.08 27.3,37.47 28.57,38.73 JP4.7 28.65,40.72 28.65,41.86 26.07,44.45 CN5.P$19
  Bottom 0.203: CN8.P$20 27.84,32.92 29.84,34.92 29.84,37.47 28.57,38.73 JP4.7 28.46,40.75 CN7.P$13
N$52
  Top 0.203: CN6.P$13 27.04,30.08 28.65,31.7 28.65,35.48 JP3.7 28.57,37.47 29.84,38.73 29.84,41.27 26.57,44.55 CN5.P$20
  Bottom 0.203: 28.57,36.17 JP3.7 | 28.57,36.17 28.57,37.47 27.3,38.73 27.3,41.27 27.46,41.43 CN7.P$14 | CN8.P$19 27,32.89 28.45,34.34 28.45,36.04 28.57,36.17
N$53
  Top 0.203: CN6.P$12 27.66,30.09 29.84,32.28 29.84,37.47 31.11,38.73 JP4.6 27.07,44.69 CN5.P$21
  Bottom 0.203: CN8.P$22 29.53,32.58 31.09,34.14 31.6,34.14 32.38,34.92 32.38,37.47 31.11,38.73 JP4.6 31.09,40.66 31.09,42.47 30.46,43.1 CN7.P$11
N$54
  Top 0.203: CN6.P$11 28.27,30.1 31.09,32.92 31.09,35.53 JP3.6 31.11,37.47 32.38,38.73 32.38,41.27 31.8,41.86 30.48,41.86 27.57,44.77 CN5.P$22
  Bottom 0.203: CN8.P$21 28.68,32.75 30.68,34.75 30.68,35.13 JP3.6 31.11,37.47 29.84,38.73 29.84,41.27 29.46,41.66 CN7.P$12
N$55
  Top 0.203: CN6.P$10 28.89,30.11 32.38,33.6 32.38,37.47 33.66,38.73 JP4.5 32.92,41.38 32.92,41.45 32.11,42.27 30.68,42.27 28.07,44.88 CN5.P$23
  Bottom 0.203: CN8.P$24 31.22,32.24 33.12,34.14 34.14,34.14 34.92,34.92 34.92,37.47 33.66,38.73 JP4.5 33.53,40.77 33.53,42.06 32.46,43.13 CN7.P$9
N$56
  Top 0.203: CN6.P$9 29.52,30.12 33.73,34.34 33.73,35.48 JP3.5 33.66,37.47 34.92,38.73 34.92,41.27 34.34,41.86 33.33,41.86 32.51,42.67 30.89,42.67 28.57,44.99 CN5.P$24
  Bottom 0.203: CN8.P$23 30.38,32.28 JP3.5 33.66,37.47 32.38,38.73 32.38,42.19 31.46,43.11 CN7.P$10
N$57
  Top 0.203: CN6.P$8 30.14,30.14 33.73,33.73 34.34,33.73 34.92,34.31 34.92,37.47 36.2,38.73 JP4.4 34.98,41.86 34.95,41.86 34.54,42.27 33.53,42.27 32.72,43.08 31.09,43.08 29.07,45.1 CN5.P$25
  Bottom 0.203: CN8.P$26 32.91,31.28 35.36,33.73 36.27,33.73 37.47,34.92 37.47,37.47 36.2,38.73 JP4.4 36.17,40.66 36.17,41.45 34.46,43.16 CN7.P$7
N$58
  Top 0.203: CN6.P$7 30.75,30.14 33.93,33.33 35.76,33.33 36.17,33.73 36.17,35.53 JP3.4 36.2,37.47 37.47,38.73 37.47,41.27 36.88,41.86 35.56,41.86 34.75,42.67 33.73,42.67 32.92,43.48 31.29,43.48 29.57,45.21 CN5.P$26
  Bottom 0.203: CN8.P$25 32.06,31.25 35.56,34.75 35.56,34.92 JP3.4 36.2,37.47 34.92,38.73 34.92,41.88 33.46,43.35 CN7.P$8
N$59
  Top 0.203: CN6.P$6 31.38,30.16 34.14,32.92 36.98,32.92 37.47,33.4 37.47,37.47 38.73,38.73 JP4.3 37.59,41.78 37.59,41.86 37.19,42.27 35.76,42.27 34.95,43.08 33.93,43.08 33.12,43.89 31.5,43.89 30.07,45.32 CN5.P$27
  Bottom 0.203: CN8.P$28 34.6,30.54 38.2,34.14 39.22,34.14 40.01,34.92 40.01,37.47 38.73,38.73 JP4.3 38.61,40.77 38.61,41.66 36.46,43.8 CN7.P$5
N$60
  Top 0.203: CN6.P$5 32,30.17 34.34,32.51 38,32.51 38.81,33.33 38.81,35.48 JP3.3 38.73,37.47 40.01,38.73 40.01,41.27 39.42,41.86 38.41,41.86 37.59,42.67 35.97,42.67 35.15,43.48 34.14,43.48 33.33,44.3 31.7,44.3 30.57,45.43 CN5.P$28
  Bottom 0.203: CN8.P$27 33.76,30.58 JP3.3 38.73,37.47 37.47,38.73 37.47,41.27 35.46,43.28 CN7.P$6
N$61
  Top 0.203: CN6.P$4 32.62,30.18 34.54,32.11 38.2,32.11 40.01,33.91 40.01,37.47 41.27,38.73 JP4.2 39.65,42.27 38.61,42.27 37.8,43.08 36.17,43.08 35.36,43.89 34.34,43.89 33.53,44.7 31.9,44.7 31.07,45.54 CN5.P$29
  Bottom 0.203: CN8.P$30 36.29,29.58 40.64,33.93 41.55,33.93 42.55,34.92 42.55,37.47 41.27,38.73 JP4.2 41.25,40.66 41.25,41.45 38.46,44.24 CN7.P$3
N$62
  Top 0.203: CN6.P$3 33.23,30.19 34.75,31.7 38.61,31.7 41.25,34.34 41.25,35.53 JP3.2 41.27,37.47 42.55,38.73 42.55,41.27 41.96,41.86 40.64,41.86 39.83,42.67 38.81,42.67 38,43.48 36.37,43.48 35.56,44.3 34.54,44.3 33.73,45.11 32.11,45.11 31.57,45.65 CN5.P$30
  Bottom 0.203: CN8.P$29 35.45,29.73 JP3.2 41.27,37.47 40.01,38.73 40.01,41.27 37.46,43.82 CN7.P$4
N$63
  Top 0.203: CN6.P$2 33.85,30.2 34.95,31.29 38.91,31.29 42.55,34.92 42.55,37.47 43.81,38.73 JP4.1 42.19,42.27 40.84,42.27 40.03,43.08 39.01,43.08 38.2,43.89 36.58,43.89 35.76,44.7 34.75,44.7 33.93,45.52 32.31,45.52 32.06,45.76 CN5.P$31
  Bottom 0.203: CN8.P$32 37.98,29.45 40.84,32.31 42.47,32.31 45.09,34.92 45.09,37.47 43.81,38.73 JP4.1 43.89,40.72 43.89,41.45 40.46,44.88 CN7.P$1
N$64
  Top 0.203: CN6.P$1 34.48,30.21 35.15,30.89 39.14,30.89 JP3.1 43.81,37.47 45.09,38.73 45.09,41.27 44.5,41.86 43.28,41.86 42.47,42.67 41.05,42.67 40.23,43.48 39.22,43.48 38.41,44.3 36.78,44.3 35.97,45.11 34.95,45.11 34.14,45.92 32.72,45.92 32.56,46.07 CN5.P$32
  Bottom 0.203: CN8.P$31 37.13,29.41 40.84,33.12 41.38,33.12 JP3.1 43.81,37.47 42.55,38.73 42.55,41.27 39.46,44.36 CN7.P$2

### Text on the board
tPlace: 0.50mm | SmallRoomLabs.com | 1 | 3 | 5 | 7 | 9 | 11 | 13 | 15 | 17 | 19 | 21 | 23 | 25 | 27 | 29 | 31 | 32 | 30 | 28 | 26 | 24 | 22 | 20 | 18 | 16 | 14 | 12 | 10 | 8 | 6 | 4 | 2 | 2 | 4 | 6 | 8 | 10 | 12 | 14 | 16 | 18 | 20 | 22 | 24 | 26 | 28 | 30 | 32 | 31 | 29 | 27 | 25 | 23 | 21 | 19 | 17 | 15 | 13 | 11 | 9 | 7 | 5 | 3 | 1 | SmallRoomLabs.com | 0.62mm | 0.60mm | SmallRoomLabs.com | 1 | 3 | 5 | 7 | 9 | 11 | 13 | 15 | 17 | 19 | 21 | 23 | 25 | 27 | 29 | 31 | 32 | 30 | 28 | 26 | 24 | 22 | 20 | 18 | 16 | 14 | 12 | 10 | 8 | 6 | 4 | 2 | 2 | 4 | 6 | 8 | 10 | 12 | 14 | 16 | 18 | 20 | 22 | 24 | 26 | 28 | 30 | 32 | 31 | 29 | 27 | 25 | 23 | 21 | 19 | 17 | 15 | 13 | 11 | 9 | 7 | 5 | 3 | 1 | SmallRoomLabs.com | 0.65mm
bPlace: SmallRoomLabs.com | 1.0mm | 31 | 29 | 27 | 25 | 23 | 21 | 19 | 17 | 15 | 13 | 11 | 9 | 7 | 5 | 3 | 1 | 2 | 4 | 6 | 8 | 10 | 12 | 14 | 16 | 18 | 20 | 22 | 24 | 26 | 28 | 30 | 32 | 32 | 30 | 28 | 26 | 24 | 22 | 20 | 18 | 16 | 14 | 12 | 10 | 8 | 6 | 4 | 2 | 1 | 3 | 5 | 7 | 9 | 11 | 13 | 15 | 17 | 19 | 21 | 23 | 25 | 27 | 29 | 31 | 0.845mm | SmallRoomLabs.com | SmallRoomLabs.com | 0.70mm | 31 | 29 | 27 | 25 | 23 | 21 | 19 | 17 | 15 | 13 | 11 | 9 | 7 | 5 | 3 | 1 | 2 | 4 | 6 | 8 | 10 | 12 | 14 | 16 | 18 | 20 | 22 | 24 | 26 | 28 | 30 | 32 | 32 | 30 | 28 | 26 | 24 | 22 | 20 | 18 | 16 | 14 | 12 | 10 | 8 | 6 | 4 | 2 | 1 | 3 | 5 | 7 | 9 | 11 | 13 | 15 | 17 | 19 | 21 | 23 | 25 | 27 | 29 | 31 | 0.80mm | SmallRoomLabs.com